# Altium project Front.PrjPCB (part 2 of 2)

## Sheet Connectors.SchDoc
size A; SheetNumber: 13
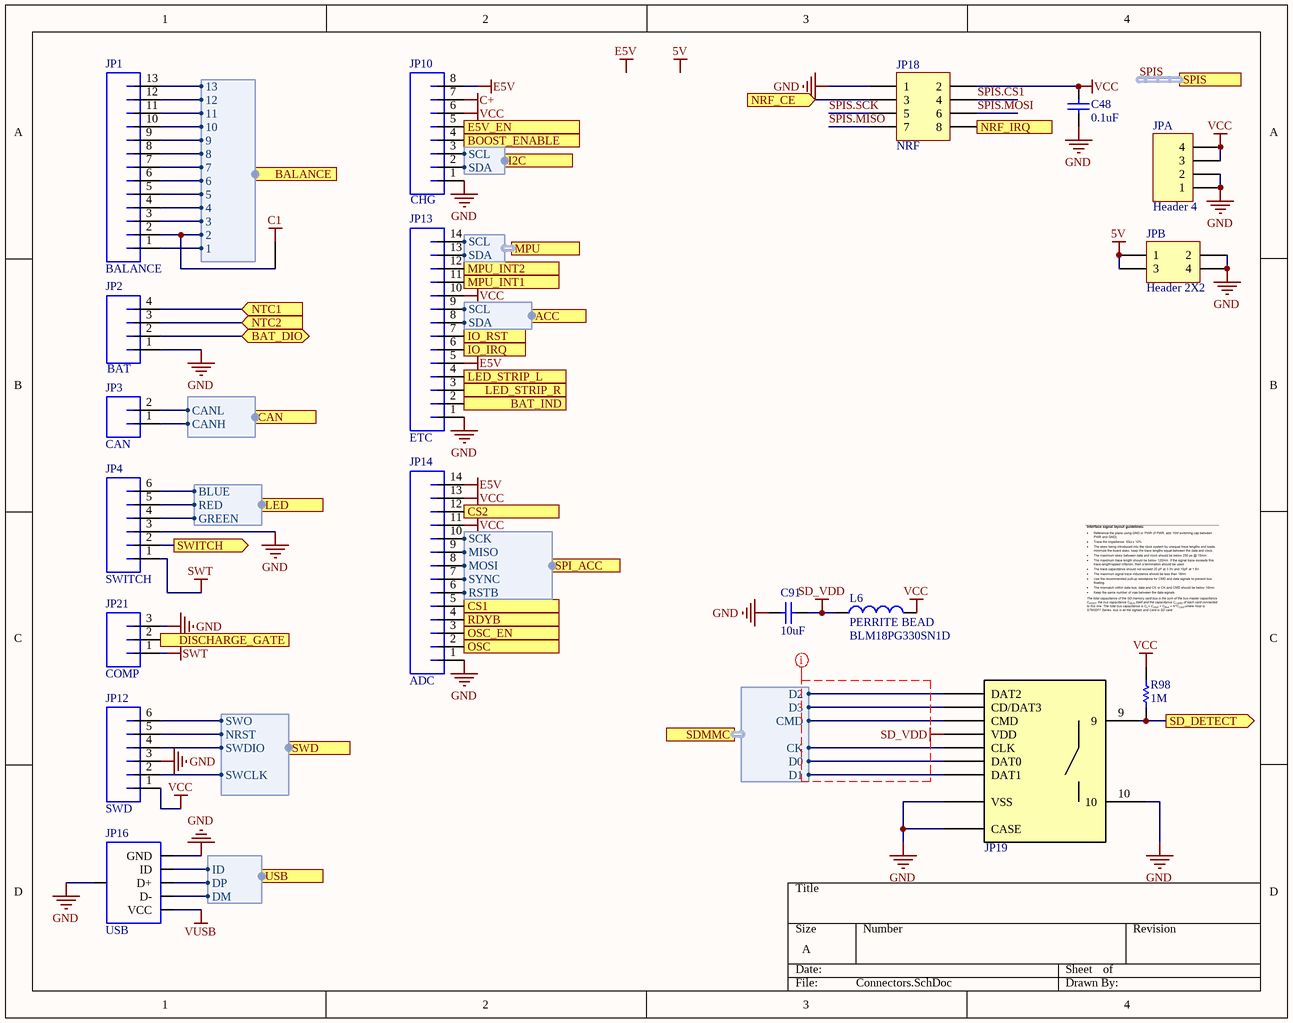
[diagram p6: Connectors.SchDoc]

### Parts
(Parts that share a designator on the sheet are numbered #1, #2 ... from top to bottom, then left to right.)
*1  NetTie  [NetTie]  (value not drawn)  (net tie, no BOM)
C48  value 0.1uF  [C0603[1608X92]]  (hidden comment: 0.1uF 6.3V 0603)
C91  value 10uF  [C0603[1608X92]]  (hidden comment: 10uF 16V 0603)
JP1  BALANCE  [JST-XH-13-PTH-VERT]
JP2  BAT  [JST-PH-4-PTH-VERT]
JP3  CAN  [JST-PH-2-PTH-HORZ]
JP4  SWITCH  [JST-PH-6-PTH-HORZ]
JP10  CHG  [JST-PH-8-PTH-HORZ]
JP12  SWD  [MOLEX_5045_6]
JP13  ETC  [JST-PH-14-PTH-HORZ]
JP14  ADC  [JST-PH-14-PTH-HORZ]
JP16  USB  [USB-MICROB_HORZ]
JP18  NRF  [HDR2X4]
JP19  MICRO SD TOP MOUNT  [MICRO SD_502570]  (value not drawn)
JP21  COMP  [JST-PH-3-PTH-HORZ]
JPA  Header 4  [HDR1X4]
JPB  Header 2X2  [HDR2X2]
L6#2  Type: PERRITE BEAD  PartNumber: BLM18PG330SN1D  [IND0603]  (hidden comment: 33Ohm)
R98  value 1M  [R0603[1608]]  (hidden comment: 1M 5% 0603)

### Ports
ACC (harness I2C), BALANCE (harness Balance), BAT_DIO (bidir), BAT_IND (in), BOOST_ENABLE (in), CAN (harness CAN Output), CS1 (out), CS2 (out), DISCHARGE_GATE (out), E5V_EN (in), I2C (harness I2C), IO_IRQ (out), IO_RST (in), LED (harness LED), LED_STRIP_L (in), LED_STRIP_R (in), MPU (harness I2C), MPU_INT1 (out), MPU_INT2 (out), NRF_CE (in), NRF_IRQ (out), NTC1 (in), NTC2 (in), OSC (out), OSC_EN (out), RDYB (out), SD_DETECT (out), SDMMC (harness SDMMC), SPI_ACC (harness SPI_ADC), SPIS (harness SPI), SWD (harness SWD), SWITCH (out), USB (harness USB)

### Harnesses
CAN Output: CANL, CANH
Balance: 13, 12, 11, 10, 9, 8, 6, 7, 5, 3, 4, 2, 1
I2C: SCL, SDA
SWD: SWCLK, SWDIO, SWO, NRST
LED: RED, BLUE, GREEN
SDMMC: D2, D3, CMD, CK, D0, D1
SPI_ADC: MOSI, MISO, SCK, SYNC, RSTB
USB: DM, DP, ID

### Nets
5V: JPB.1 JPB.3
C1: *1.2
C+: JP10.7
E5V: JP10.8 JP13.5 JP14.14
GND: C48.1 C91.2 JP2.1 JP4.3 JP10.1 JP12.3 JP13.1 JP14.1 JP16.GND JP16.MT1(SHIELD) JP18.1 JP19.10 JP19.CASE JP19.VSS JP21.3 JPA.1 JPA.2 JPB.2 JPB.4
SD_VDD: C91.1 JP19.VDD L6#2.1
SWT: JP4.1 JP21.1
VCC: C48.2 JP10.6 JP12.1 JP13.10 JP14.11 JP14.13 JP18.2 JPA.3 JPA.4 L6#2.2 R98.1
VUSB: JP16.VBUS(VCC)
ACC.SCL: JP13.9 ; port ACC.SCL
ACC.SDA: JP13.8 ; port ACC.SDA
BAT_DIO: JP2.2 ; port BAT_DIO
BAT_IND: JP13.2 ; port BAT_IND
BOOST: JP10.4 ; port BOOST_ENABLE
CELL0: JP1.1 ; port BALANCE.1
CELL1: *1.1 JP1.2 ; port BALANCE.2
CELL2: JP1.3 ; port BALANCE.3
CELL3: JP1.4 ; port BALANCE.4
CELL4: JP1.5 ; port BALANCE.5
CELL5: JP1.6 ; port BALANCE.6
CELL6: JP1.7 ; port BALANCE.7
CELL7: JP1.8 ; port BALANCE.8
CELL8: JP1.9 ; port BALANCE.9
CELL9: JP1.10 ; port BALANCE.10
CELL10: JP1.11 ; port BALANCE.11
CELL11: JP1.12 ; port BALANCE.12
CELL12: JP1.13 ; port BALANCE.13
I2C_MPU.SCL: JP13.14 ; port MPU.SCL
I2C_MPU.SDA: JP13.13 ; port MPU.SDA
I2C_SYS.SCL: JP10.3 ; port I2C.SCL
I2C_SYS.SDA: JP10.2 ; port I2C.SDA
IO_IRQ: JP13.6 ; port IO_IRQ
IO_RST: JP13.7 ; port IO_RST
LED.BLUE: JP4.6 ; port LED.BLUE
LED.GREEN: JP4.4 ; port LED.GREEN
LED.RED: JP4.5 ; port LED.RED
LED_STRIP_L: JP13.3 ; port LED_STRIP_R
LED_STRIP_R: JP13.4 ; port LED_STRIP_L
MPU_INT1: JP13.11 ; port MPU_INT1
MPU_INT2: JP13.12 ; port MPU_INT2
NRF_CE: JP18.3 ; port NRF_CE
NRF_IRQ: JP18.8 ; port NRF_IRQ
SD.CK: JP19.CLK ; port SDMMC.CK
SD.CMD: JP19.CMD ; port SDMMC.CMD
SD.D0: JP19.DAT0 ; port SDMMC.D0
SD.D1: JP19.DAT1 ; port SDMMC.D1
SD.D2: JP19.DAT2 ; port SDMMC.D2
SD.D3: JP19.CD/DAT3 ; port SDMMC.D3
SD_DETECT: JP19.9 R98.2 ; port SD_DETECT
SPI_ACC.MISO: JP14.9 ; port SPI_ACC.MISO
SPI_ACC.MOSI: JP14.8 ; port SPI_ACC.MOSI
SPI_ACC.RSTB: JP14.6 ; port SPI_ACC.RSTB
SPI_ACC.SCK: JP14.10 ; port SPI_ACC.SCK
SPI_ACC.SYNC: JP14.7 ; port SPI_ACC.SYNC
SPIS.CS1: JP18.4
SPIS.MISO: JP18.7
SPIS.MOSI: JP18.6
SPIS.SCK: JP18.5
SWD.NRST: JP12.5 ; port SWD.NRST
SWD.SWCLK: JP12.2 ; port SWD.SWCLK
SWD.SWDIO: JP12.4 ; port SWD.SWDIO
SWD.SWO: JP12.6 ; port SWD.SWO
USB_ID: JP16.ID ; port USB.ID
USB_N: JP16.D- ; port USB.DM
USB_P: JP16.D+ ; port USB.DP
NetC1_2: JP2.4 ; port NTC1
NetC90_2: JP2.3 ; port NTC2
NetJP3_1: JP3.1 ; port CAN.CANH
NetJP3_2: JP3.2 ; port CAN.CANL
NetJP4_2: JP4.2 ; port SWITCH
NetJP10_5: JP10.5 ; port E5V_EN
NetJP14_2: JP14.2 ; port OSC
NetJP14_3: JP14.3 ; port OSC_EN
NetJP14_4: JP14.4 ; port RDYB
NetJP14_5: JP14.5 ; port CS1
NetJP14_12: JP14.12 ; port CS2
NetJP21_2: JP21.2 ; port DISCHARGE_GATE

### Buses and harness runs
harness SPIS = port SPIS

### Layout directives
rule Width Constraint [Pref Width = 11.55mil    Min Width = 11.55mil    Max Width = 11.55mil]; net class SD; rule Matched Net Lengths [Tolerance = 100mil]: (no net found under the mark)

### Notes on the sheet
- Labels drawn without touching a wire or pin: 5V, E5V

### Library data of the parts
C48 = CAP_0.1uF_6.3V_0603_10%: as C18 on sheet Charging; Mounting Technology: Surface Mount; PackageReference: 0603; PackageDescription: 0603 (1608 Metric); Voltage: 6.3V; Tolerance: 10%
C91 = CAP_10uF_16V_0603_10%: as C16 on sheet Charging; Mounting Technology: Surface Mount; PackageReference: 0603; PackageDescription: 0603 (1608 Metric); Voltage: 16V; Tolerance: 10%
JP1 = JST_XH_13_VERT: Manufacturer: JST Sales America, Inc.; PartNumber: B13B-XH-A(LF)(SN); Mounting Technology: Through Hole; PackageReference: JST-XH
JP2 = JST_PH_4_VERT: Manufacturer: JST Sales America Inc.; PartNumber: B4B-PH-K-S(LF)(SN); Mounting Technology: Through Hole; PackageReference: JST-PH
JP3 = JST_PH_2_HORZ: Manufacturer: JST Sales America Inc.; PartNumber: B2B-PH-K-S(LF)(SN); Mounting Technology: Through Hole; PackageReference: JST-PH
JP4 = JST_PH_6_HORZ: PartNumber: S6B-PH-K-S; Manufacturer: JST Sales America Inc.; PackageReference: JST-PH; Mounting Technology: Through Hole
JP10 = JST_PH_8_HORZ: PartNumber: S8B-PH-K-S(LF)(SN); Manufacturer: JST Sales America Inc.; PackageReference: JST-PH; Mounting Technology: Through Hole
JP12 = MOLEX_5045_6: PartNumber: B6B-PH-K-S(LF)(SN); Manufacturer: JST Sales America Inc.; PackageReference: JST-PH; Mounting Technology: Through Hole
JP13 JP14 = JST_PH_14_HORZ: PartNumber: S14B-PH-K-S(LF)(SN); Manufacturer: JST Sales America Inc.; Mounting Technology: Through Hole; PackageReference: JST-PH
JP16 = USB_MICROB_HORZ: pin to pad: MT1>MT1+P$1+P$2+MT2; PartNumber: 10118192-0001LF; Manufacturer: Amphenol FCI; Mounting Technology: Surface Mount; PackageReference: USB - Micro B
JP18 = Header 4X2: Header, 4-Pin, Dual row; LatestRevisionDate: 17-Jul-2002; LatestRevisionNote: Re-released for DXP Platform.; Publisher: Altium Limited
JP19 = MICRO SD_5025: MICRO SD Slot / TOP MOUNT / FRONT; Manufacturer: Molex; PartNumber: 5025700893; Mounting Technology: SMD; PackageReference: Header-1.27mm-2x5
JP21 = JST_PH_3_HORZ: Manufacturer: JST Sales America Inc.; PartNumber: B3B-PH-K-S(LF)(SN); Mounting Technology: Through Hole; PackageReference: JST-PH
JPA = Header 4: Header, 4-Pin; LatestRevisionDate: 17-Jul-2002; LatestRevisionNote: Re-released for DXP Platform.; Publisher: Altium Limited
JPB = Header 2X2: Header, 2-Pin, Dual row; LatestRevisionDate: 17-Jul-2002; LatestRevisionNote: Re-released for DXP Platform.; Publisher: Altium Limited
L6#2 = PER_33Ohm_3A_0603: 33Ohm 3A 0603 Perrite Bead; Manufacturer: Murata; PackageReference: 0603; PackageDescription: 0603 (1608 metric); Mounting Technology: Surface Mount; Current: 3A; Value: 33Ohm
R98 = RES_1M_0603_5%: as R67 on sheet MCU; Tolerance: 5%; Power: 0.25W; Mounting Technology: Surface Mount; PackageReference: 0603; PackageDescription: 0603 (1608 Metric); ComponentLink1Description: Datasheet; ComponentLink1URL: http://www.vishay.com/docs/20043/crcwhpe3.pdf

## Sheet CAN.SchDoc
size A; SheetNumber: 9
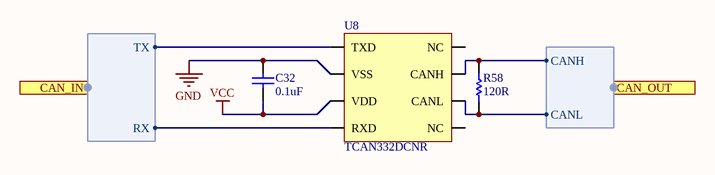
[diagram p7: CAN.SchDoc]

### Parts
C32  value 0.1uF  [C0603[1608X92]]  (hidden comment: 0.1uF 6.3V 0603)
R58  value 120R  [R0603[1608]]  (hidden comment: 120R 1% 0603)
U8  TCAN332DCNR  [SOT-23-8]

### Ports
CAN_IN (harness CAN Input), CAN_OUT (harness CAN Output)

### Harnesses
CAN Input: TX, RX
CAN Output: CANH, CANL

### Nets
GND: C32.2 U8.2(VSS)
VCC: C32.1 U8.3(VDD)
CAN.RX: U8.4(RXD) ; port CAN_IN.RX
CAN.TX: U8.1(TXD) ; port CAN_IN.TX
NetJP3_1: R58.2 U8.7(CANH) ; port CAN_OUT.CANH
NetJP3_2: R58.1 U8.6(CANL) ; port CAN_OUT.CANL

Not connected (* = marked no-connect by the designer): U8 5(NC) 8(NC)

### Library data of the parts
C32 = CAP_0.1uF_6.3V_0603_10%: as C18 on sheet Charging; Mounting Technology: Surface Mount; PackageReference: 0603; PackageDescription: 0603 (1608 Metric); Voltage: 6.3V; Tolerance: 10%
R58 = RES_120R_0603_1%: 120R 0.25W 1% 0603 (1005 Metric); Manufacturer: Vishay / Dale; PartNumber: CRCW0603120RFKEAHP; Tolerance: 1%; Power: 0.25W; Mounting Technology: Surface Mount; PackageReference: 0603; PackageDescription: 0603 (1608 Metric); ComponentLink1Description: Datasheet; ComponentLink1URL: http://www.vishay.com/docs/20043/crcwhpe3.pdf
U8 = TCAN332DCNR: CAN Interface IC 3.3-V CAN Transceivers with CAN FD (Flexible Data Rate) 8-SOT-23 -40 to 125; Manufacturer: Texas Instruments; Mounting Technology: Surface Mount; PackageReference: SOT-23-8; PackageDescription: SOT23, 8-Leads; PartNumber: TCAN332DCNR

## Sheet RTCC.SchDoc
size A; SheetNumber: 10
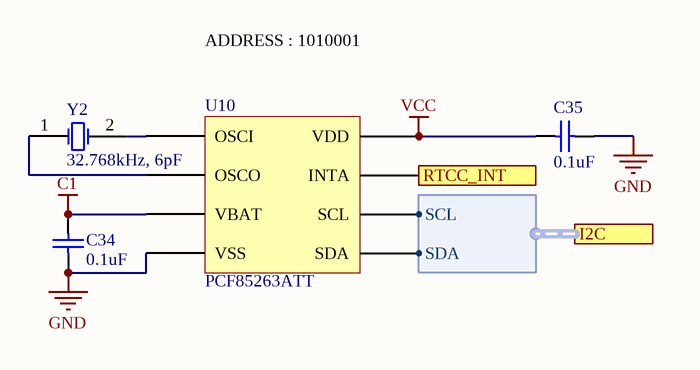
[diagram p8: RTCC.SchDoc]

### Parts
C34  value 0.1uF  [C0603[1608X92]]  (hidden comment: 0.1uF 6.3V 0603)
C35  value 0.1uF  [C0603[1608X92]]  (hidden comment: 0.1uF 6.3V 0603)
U10  PCF85263ATT  [TSSOP-8]
Y2  32.768kHz, 6pF  [ST3215SB]

### Ports
I2C (harness I2C), RTCC_INT (out)

### Harnesses
I2C: SCL, SDA

### Nets
C1: C34.2 U10.3(VBAT)
GND: C34.1 C35.2 U10.4(VSS)
VCC: C35.1 U10.8(VDD)
I2C_SYS.SCL: U10.6(SCL) ; port I2C.SCL
I2C_SYS.SDA: U10.5(SDA) ; port I2C.SDA
RTCC_INT: U10.7(INTA) ; port RTCC_INT
NetU10_1: U10.1(OSCI) Y2.2(X2)
NetU10_2: U10.2(OSCO) Y2.1(X1)

### Notes on the sheet
- ADDRESS : 1010001

### Library data of the parts
C34 C35 = CAP_0.1uF_6.3V_0603_10%: as C18 on sheet Charging; Mounting Technology: Surface Mount; PackageReference: 0603; PackageDescription: 0603 (1608 Metric); Voltage: 6.3V; Tolerance: 10%
U10 = PCF85263ATT: Real Time Clock Real-Time Clock calendar; PartNumber: PCF85263ATT/AJ; Manufacturer: Texas Instruments; Mounting Technology: Surface Mount; PackageReference: TSSOP-8
Y2 = ST3215SB32768B0HPWB3: 32.768kHz ±20ppm Crystal 6pF 60 kOhm -40°C ~ 85°C Surface Mount 2-SMD, No Lead (DFN, LCC); Manufacturer: AVX/Kyocera; PackageDescription: 2-SMD, No Lead (DFN, LCC); PackageReference: ST3215SB; Mounting Technology: Surface Mount; PartNumber: ST3215SB32768B0HPWB3

## Sheet Buzzer.SchDoc
size A; SheetNumber: 11
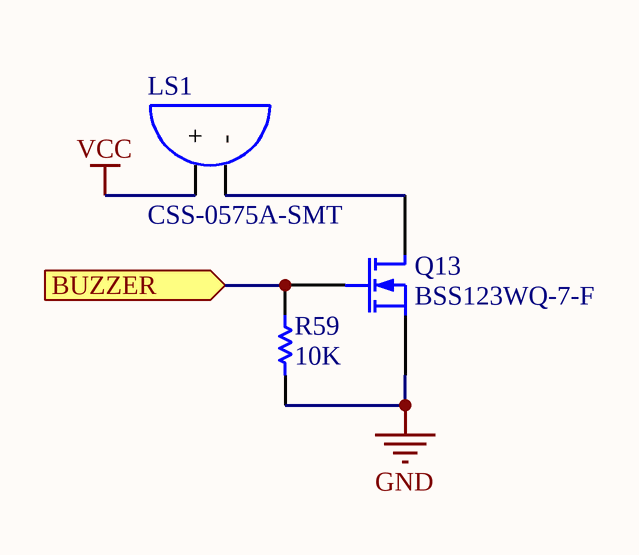
[diagram p9: Buzzer.SchDoc]

### Parts
LS1  CSS-0575A-SMT  [CSS-0575A-SMT]
Q13  BSS123WQ-7-F  [SOT323-3]
R59  value 10K  [R0603[1608]]  (hidden comment: 10K 1% 0603)

### Ports
BUZZER (in)

### Nets
GND: Q13.2(S) R59.1
VCC: LS1.1(+)
BUZZER: Q13.1(G) R59.2 ; port BUZZER
NetLS1_2: LS1.2(-) Q13.3(D)

### Library data of the parts
LS1 = CSS-0575A-SMT: Magnetic Buzzer Transducer; Manufacturer: CUI, Inc.; PartNumber: CSS-0575A-SMT; Mounting Technology: Surface Mount; PackageReference: 5x5x1.9mm
Q13 = BSS123WQ-7-F: N-Channel MOSFET; Manufacturer: Diodes Incorporated; PackageReference: SOT-323-3; PartNumber: BSS123WQ-7-F; Mounting Technology: Surface Mount
R59 = RES_10K_0603_1%: as R28 on sheet Charging; Tolerance: 1%; Power: 0.25W; Mounting Technology: Surface Mount; PackageReference: 0603; PackageDescription: 0603 (1608 Metric); ComponentLink1Description: Datasheet; ComponentLink1URL: http://www.vishay.com/docs/20065/rcse3.pdf

## Sheet CurrentSense.SchDoc
size A; SheetNumber: 8
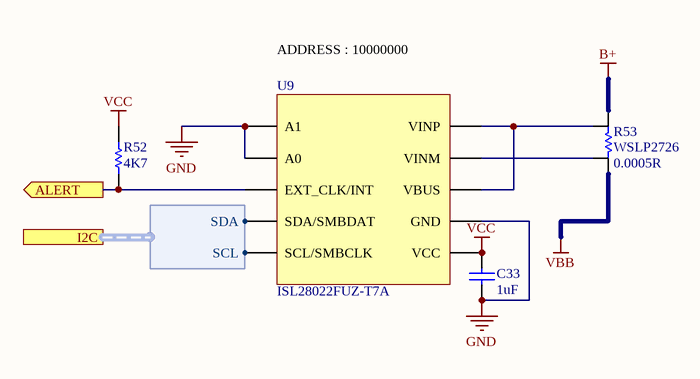
[diagram p10: CurrentSense.SchDoc]

### Parts
C33  value 1uF  [C0603[1608X92]]  (hidden comment: 1uF 6.3V 0603)
R52  value 4K7  [R0603[1608]]  (hidden comment: 4K7 1% 0603)
R53  WSLP2726  value 0.0005R  [WSL2726]
U9  ISL28022FUZ-T7A  [MSOP-10]

### Ports
ALERT (out), I2C (harness I2C)

### Harnesses
I2C: SCL, SDA

### Nets
B+: R53.2
GND: C33.1 U9.1(A1) U9.2(A0) U9.7(GND)
VBB: R53.1
VCC: C33.2 R52.2 U9.6(VCC)
ALERT: R52.1 U9.3(EXT_CLK/INT) ; port ALERT
I2C_SYS.SCL: U9.5(SCL/SMBCLK) ; port I2C.SCL
I2C_SYS.SDA: U9.4(SDA/SMBDAT) ; port I2C.SDA
NetR53_3: R53.3 U9.9(VINM)
NetR53_4: R53.4 U9.8(VBUS) U9.10(VINP)

### Notes on the sheet
- ADDRESS : 10000000

### Library data of the parts
C33 = CAP_1uF_6.3V_0603_10%: as C26 on sheet 3V3; Mounting Technology: Surface Mount; PackageReference: 0603; PackageDescription: 0603 (1608 Metric); Voltage: 6.3V; Tolerance: 10%
R52 = RES_4K7_0603_1%: 4K7 0.25W 1% 0603 (1005 Metric); Manufacturer: Vishay / Dale; PartNumber: CRCW06034K70FKEAHP; Tolerance: 1%; Power: 0.25W; Mounting Technology: Surface Mount; PackageReference: 0603; PackageDescription: 0603 (1608 Metric); ComponentLink1Description: Datasheet; ComponentLink1URL: http://www.vishay.com/docs/20043/crcwhpe3.pdf
R53 = WSLP2726: Current Sense Resistor, 0.0005R; PartNumber: WSLP2726L5000FEA; Manufacturer: Vishay / Dale; Power: 7W; Tolerance: 1%; PackageReference: 2726; Mounting Technology: Surface Mount
U9 = ISL28022FUZ-T7A: Manufacturer: Intersil; PartNumber: ISL28022FUZ-T7A; Mounting Technology: Surface Mount; PackageReference: MSOP-10

## Sheet LTC6803.SchDoc
size A; SheetNumber: 4
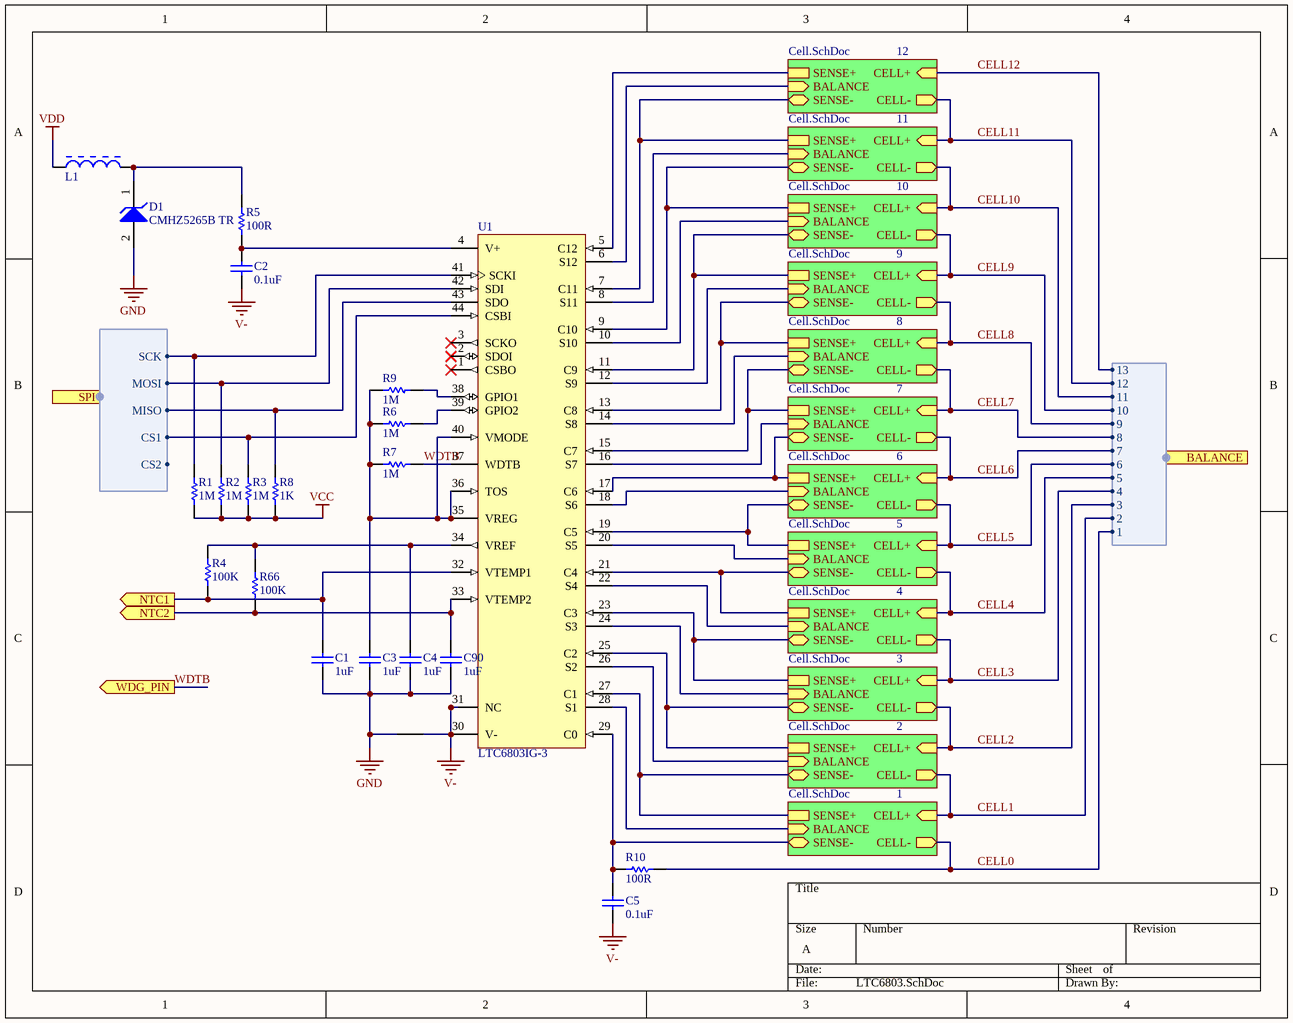
[diagram p11: LTC6803.SchDoc]

### Parts
*  NetTie  [NetTie]  (value not drawn)  (net tie, no BOM)
C1  value 1uF  [C0603[1608X92]]  (hidden comment: 1uF 6.3V 0603)
C2  value 0.1uF  [C0603[1608X92]]  (hidden comment: 0.1uF 100V 0603)
C3  value 1uF  [C0603[1608X92]]  (hidden comment: 1uF 6.3V 0603)
C4  value 1uF  [C0603[1608X92]]  (hidden comment: 1uF 6.3V 0603)
C5  value 0.1uF  [C0603[1608X92]]  (hidden comment: 0.1uF 6.3V 0603)
C90  value 1uF  [C0603[1608X92]]  (hidden comment: 1uF 6.3V 0603)
D1  CMHZ5265B TR  [SOD-123]
L1  MURA-FB-2  [MURA-BLM31-B60-CHIP-2_V3]  (value not drawn)
R1  value 1M  [R0603[1608]]  (hidden comment: 1M 5% 0603)
R2  value 1M  [R0603[1608]]  (hidden comment: 1M 5% 0603)
R3  value 1M  [R0603[1608]]  (hidden comment: 1M 5% 0603)
R4  value 100K  [R0603[1608]]  (hidden comment: 100K 1% 0603)
R5  value 100R  [R0603[1608]]  (hidden comment: 100R 1% 0603)
R6  value 1M  [R0603[1608]]  (hidden comment: 1M 5% 0603)
R7  value 1M  [R0603[1608]]  (hidden comment: 1M 5% 0603)
R8  value 1K  [R0603[1608]]  (hidden comment: 1K 1% 0603)
R9  value 1M  [R0603[1608]]  (hidden comment: 1M 5% 0603)
R10  value 100R  [R0603[1608]]  (hidden comment: 100R 1% 0603)
R66  value 100K  [R0603[1608]]  (hidden comment: 100K 1% 0603)
U1  LTC6803IG-3  [TSSOP-44]

### Sub-sheets
1 = Cell.SchDoc: SENSE+, SENSE- (bidir), BALANCE (in), CELL+ (in), CELL- (out)
2 = Cell.SchDoc: SENSE+, SENSE- (bidir), BALANCE (in), CELL+ (in), CELL- (out)
3 = Cell.SchDoc: SENSE+, SENSE- (bidir), BALANCE (in), CELL+ (in), CELL- (out)
4 = Cell.SchDoc: SENSE+, SENSE- (bidir), BALANCE (in), CELL+ (in), CELL- (out)
5 = Cell.SchDoc: SENSE+, SENSE- (bidir), BALANCE (in), CELL+ (in), CELL- (out)
6 = Cell.SchDoc: SENSE+, SENSE- (bidir), BALANCE (in), CELL+ (in), CELL- (out)
7 = Cell.SchDoc: SENSE+, SENSE- (bidir), BALANCE (in), CELL+ (in), CELL- (out)
8 = Cell.SchDoc: SENSE+, SENSE- (bidir), BALANCE (in), CELL+ (in), CELL- (out)
9 = Cell.SchDoc: SENSE+, SENSE- (bidir), BALANCE (in), CELL+ (in), CELL- (out)
10 = Cell.SchDoc: SENSE+, SENSE- (bidir), BALANCE (in), CELL+ (in), CELL- (out)
11 = Cell.SchDoc: SENSE+, SENSE- (bidir), BALANCE (in), CELL+ (in), CELL- (out)
12 = Cell.SchDoc: SENSE+, SENSE- (bidir), BALANCE (in), CELL+ (in), CELL- (out)

### Ports
BALANCE (harness Balance), NTC1 (out), NTC2 (out), SPI (harness SPI), WDG_PIN (out)

### Harnesses
SPI: SCK, MOSI, MISO, CS1, CS2
Balance: 13, 12, 11, 10, 9, 8, 6, 7, 5, 3, 4, 2, 1

### Nets
GND: *.1 C1.1 C3.1 C4.1 C90.1 D1.2(A)
V-: *.2 C2.1 C5.1 U1.30(V-) U1.31(NC)
VCC: R1.1 R2.1 R3.1 R8.1
VDD: L1.1
CELL0: R10.1 ; sheet 1/CELL-, port BALANCE.1
CELL1: sheet 2/CELL-, sheet 1/CELL+, port BALANCE.2
CELL2: sheet 3/CELL-, sheet 2/CELL+, port BALANCE.3
CELL3: sheet 4/CELL-, sheet 3/CELL+, port BALANCE.4
CELL4: sheet 5/CELL-, sheet 4/CELL+, port BALANCE.5
CELL5: sheet 6/CELL-, sheet 5/CELL+, port BALANCE.6
CELL6: sheet 7/CELL-, sheet 6/CELL+, port BALANCE.7
CELL7: sheet 8/CELL-, sheet 7/CELL+, port BALANCE.8
CELL8: sheet 9/CELL-, sheet 8/CELL+, port BALANCE.9
CELL9: sheet 10/CELL-, sheet 9/CELL+, port BALANCE.10
CELL10: sheet 11/CELL-, sheet 10/CELL+, port BALANCE.11
CELL11: sheet 12/CELL-, sheet 11/CELL+, port BALANCE.12
CELL12: sheet 12/CELL+, port BALANCE.13
SPI_SYS.CS1: R3.2 U1.44(CSBI) ; port SPI.CS1
SPI_SYS.MISO: R8.2 U1.43(SDO) ; port SPI.MISO
SPI_SYS.MOSI: R2.2 U1.42(SDI) ; port SPI.MOSI
SPI_SYS.SCK: R1.2 U1.41(SCKI) ; port SPI.SCK
WDTB: R7.1 U1.37(WDTB) ; port WDG_PIN
NetC1_2: C1.2 R4.1 U1.32(VTEMP1) ; port NTC1
NetC2_2: C2.2 R5.1 U1.4(V+)
NetC3_2: C3.2 R6.2 R7.2 R9.2 U1.35(VREG) U1.36(TOS) U1.40(VMODE)
NetC4_2: C4.2 R4.2 R66.2 U1.34(VREF)
NetC5_2: C5.2 R10.2 U1.29(C0) ; sheet 1/SENSE-
NetC23_1_2: U1.27(C1) ; sheet 2/SENSE-, sheet 1/SENSE+
NetC23_2_2: U1.25(C2) ; sheet 3/SENSE-, sheet 2/SENSE+
NetC23_3_2: U1.23(C3) ; sheet 4/SENSE-, sheet 3/SENSE+
NetC23_4_2: U1.21(C4) ; sheet 5/SENSE-, sheet 4/SENSE+
NetC23_5_2: U1.19(C5) ; sheet 6/SENSE-, sheet 5/SENSE+
NetC23_6_2: U1.17(C6) ; sheet 7/SENSE-, sheet 6/SENSE+
NetC23_7_2: U1.15(C7) ; sheet 8/SENSE-, sheet 7/SENSE+
NetC23_8_2: U1.13(C8) ; sheet 9/SENSE-, sheet 8/SENSE+
NetC23_9_2: U1.11(C9) ; sheet 10/SENSE-, sheet 9/SENSE+
NetC23_10_2: U1.9(C10) ; sheet 11/SENSE-, sheet 10/SENSE+
NetC23_11_2: U1.7(C11) ; sheet 12/SENSE-, sheet 11/SENSE+
NetC23_12_2: U1.5(C12) ; sheet 12/SENSE+
NetC90_2: C90.2 R66.1 U1.33(VTEMP2) ; port NTC2
NetD1_1: D1.1(K) L1.2 R5.2
NetQ3_1_1: U1.28(S1) ; sheet 1/BALANCE
NetQ3_2_1: U1.26(S2) ; sheet 2/BALANCE
NetQ3_3_1: U1.24(S3) ; sheet 3/BALANCE
NetQ3_4_1: U1.22(S4) ; sheet 4/BALANCE
NetQ3_5_1: U1.20(S5) ; sheet 5/BALANCE
NetQ3_6_1: U1.18(S6) ; sheet 6/BALANCE
NetQ3_7_1: U1.16(S7) ; sheet 7/BALANCE
NetQ3_8_1: U1.14(S8) ; sheet 8/BALANCE
NetQ3_9_1: U1.12(S9) ; sheet 9/BALANCE
NetQ3_10_1: U1.10(S10) ; sheet 10/BALANCE
NetQ3_11_1: U1.8(S11) ; sheet 11/BALANCE
NetQ3_12_1: U1.6(S12) ; sheet 12/BALANCE
NetR6_1: R6.1 U1.39(GPIO2)
NetR9_1: R9.1 U1.38(GPIO1)

Not connected (* = marked no-connect by the designer): U1 1(CSBO)* 2(SDOI)* 3(SCKO)*

### Library data of the parts
C1 C3 C4 C90 = CAP_1uF_6.3V_0603_10%: 1uF 6.3V 10% 0603 (1608 Metric); PartNumber: GRM188R60J105KA01D; Manufacturer: Murata; TemperatureCoefficient: X5R; Mounting Technology: Surface Mount; PackageReference: 0603; PackageDescription: 0603 (1608 Metric); Voltage: 6.3V; Tolerance: 10%
C2 = CAP_0.1uF_100V_0603_10%: 0.1uF 100V 10% 0603 (1608 Metric); PartNumber: GRM188R72A104KA35D; Manufacturer: Murata; TemperatureCoefficient: X7R; Mounting Technology: Surface Mount; PackageReference: 0603; PackageDescription: 0603 (1608 Metric); Voltage: 100V; Tolerance: 10%
C5 = CAP_0.1uF_6.3V_0603_10%: 0.1uF 6.3V 10% 0603 (1608 Metric); PartNumber: GRM188R70J104KA01D; Manufacturer: Murata; Mounting Technology: Surface Mount; PackageReference: 0603; PackageDescription: 0603 (1608 Metric); Voltage: 6.3V; Tolerance: 10%
D1 = CMHZ5265B: Zener Diodes 500mW Zener Diode 185mA 58.9V to 2V; Manufacturer: Central Semiconductor; PartNumber: CMHZ5265B; Mounting Technology: Surface Mount; PackageReference: SOD-123; PackageDescription: SOD, 2-Leads, Body 2.69x1.6mm
L1 = MURA-FB-2: EMI Filter Beads, Chips & Arrays 1206 33 OHM; PartNumber: BLM31PG330SN1L; Manufacturer: Murata; Mounting Technology: Surface Mount; PackageReference: 1206; PackageDescription: 1206 (3216 Metric)
R1-R3 R6 R7 R9 = RES_1M_0603_5%: 1M 0.25W 5% 0603 (1005 Metric); Manufacturer: Panasonic; PartNumber: ERJ-PA3J105V; Tolerance: 5%; Power: 0.25W; Mounting Technology: Surface Mount; PackageReference: 0603; PackageDescription: 0603 (1608 Metric); ComponentLink1Description: Datasheet; ComponentLink1URL: http://www.vishay.com/docs/20043/crcwhpe3.pdf
R4 R66 = RES_100K_0603_1%: 100K 0.25W 1% 0603 (1005 Metric); Manufacturer: Vishay / Dale; PartNumber: CRCW0603100KFKEAHP; Tolerance: 1%; Power: 0.25W; Mounting Technology: Surface Mount; PackageReference: 0603; PackageDescription: 0603 (1608 Metric); ComponentLink1Description: Datasheet; ComponentLink1URL: http://www.vishay.com/docs/20043/crcwhpe3.pdf
R5 R10 = RES_100R_0603_1%: 100R 0.25W 1% 0603 (1005 Metric); Manufacturer: Vishay / Dale; PartNumber: CRCW0603100RFKEAHP; Tolerance: 1%; Power: 0.25W; Mounting Technology: Surface Mount; PackageReference: 0603; PackageDescription: 0603 (1608 Metric); ComponentLink1Description: Datasheet; ComponentLink1URL: http://www.vishay.com/docs/20043/crcwhpe3.pdf
R8 = RES_1K_0603_1%: 1K 0.25W 1% 0603 (1005 Metric); Manufacturer: Vishay / Dale; PartNumber: CRCW06031K00FKEAHP; Tolerance: 1%; Power: 0.25W; Mounting Technology: Surface Mount; PackageReference: 0603; PackageDescription: 0603 (1608 Metric); ComponentLink1Description: Datasheet; ComponentLink1URL: http://www.vishay.com/docs/20043/crcwhpe3.pdf
U1 = LTC6803IG-3: PartNumber: LTC6803IG-3#PBF; Manufacturer: Linear Technology; PackageReference: TSSOP-44; Mounting Technology: Surface Mount; PackageDescription: SOP, 44-Leads, Body 13.1x5.6mm, Pitch 0.5mm

## Sheet Cell.SchDoc
size A; SheetNumber: 5
Used 12 times, as channels U_LTC6803/12, U_LTC6803/11, U_LTC6803/10, U_LTC6803/9, U_LTC6803/8, U_LTC6803/7, U_LTC6803/6, U_LTC6803/5, U_LTC6803/4, U_LTC6803/3, U_LTC6803/2, U_LTC6803/1. Parts and nets are listed once, with the designators drawn on the sheet.
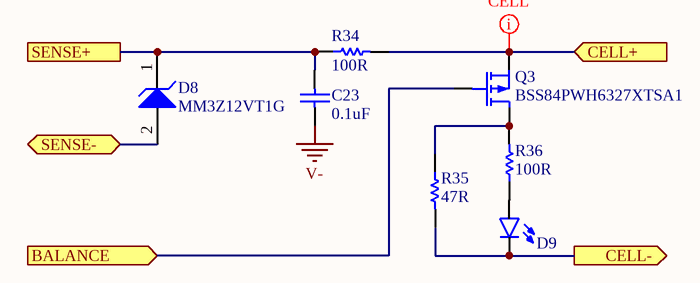
[diagram p12: Cell.SchDoc]

### Parts
C23  value 0.1uF  [C0603[1608X92]]  (hidden comment: 0.1uF 100V 0603)
D8  MM3Z12VT1G  [SOD-323]
D9  LED_0603_BLUE_5mA  [LED0603]  (value not drawn)
Q3  BSS84PWH6327XTSA1  [SOT323-3]
R34  value 100R  [R0603[1608]]  (hidden comment: 100R 1% 0603)
R35  value 47R  [R0805[2012]]  (hidden comment: 47R 5% 0805)
R36  value 100R  [R0603[1608]]  (hidden comment: 100R 1% 0603)

### Ports
BALANCE (in), CELL+ (in), CELL- (out), SENSE+, SENSE- (bidir)

### Nets
V-: C23.1
BALANCE: Q3.1(G) ; port BALANCE
CELL+: Q3.2(S) R34.1 ; port CELL+
CELL-: D9.C R35.1 ; port CELL-
SENSE+: C23.2 D8.1(K) R34.2 ; port SENSE+
SENSE-: D8.2(A) ; port SENSE-
NetD9_A: D9.A R36.2
NetQ3_3: Q3.3(D) R35.2 R36.1

### Channels
U_LTC6803/12: designators end in _12; ports BALANCE=NetQ3_12_1 CELL+=CELL12 CELL-=CELL11 SENSE+=NetC23_12_2 SENSE-=NetC23_11_2
U_LTC6803/11: designators end in _11; ports BALANCE=NetQ3_11_1 CELL+=CELL11 CELL-=CELL10 SENSE+=NetC23_11_2 SENSE-=NetC23_10_2
U_LTC6803/10: designators end in _10; ports BALANCE=NetQ3_10_1 CELL+=CELL10 CELL-=CELL9 SENSE+=NetC23_10_2 SENSE-=NetC23_9_2
U_LTC6803/9: designators end in _9; ports BALANCE=NetQ3_9_1 CELL+=CELL9 CELL-=CELL8 SENSE+=NetC23_9_2 SENSE-=NetC23_8_2
U_LTC6803/8: designators end in _8; ports BALANCE=NetQ3_8_1 CELL+=CELL8 CELL-=CELL7 SENSE+=NetC23_8_2 SENSE-=NetC23_7_2
U_LTC6803/7: designators end in _7; ports BALANCE=NetQ3_7_1 CELL+=CELL7 CELL-=CELL6 SENSE+=NetC23_7_2 SENSE-=NetC23_6_2
U_LTC6803/6: designators end in _6; ports BALANCE=NetQ3_6_1 CELL+=CELL6 CELL-=CELL5 SENSE+=NetC23_6_2 SENSE-=NetC23_5_2
U_LTC6803/5: designators end in _5; ports BALANCE=NetQ3_5_1 CELL+=CELL5 CELL-=CELL4 SENSE+=NetC23_5_2 SENSE-=NetC23_4_2
U_LTC6803/4: designators end in _4; ports BALANCE=NetQ3_4_1 CELL+=CELL4 CELL-=CELL3 SENSE+=NetC23_4_2 SENSE-=NetC23_3_2
U_LTC6803/3: designators end in _3; ports BALANCE=NetQ3_3_1 CELL+=CELL3 CELL-=CELL2 SENSE+=NetC23_3_2 SENSE-=NetC23_2_2
U_LTC6803/2: designators end in _2; ports BALANCE=NetQ3_2_1 CELL+=CELL2 CELL-=CELL1 SENSE+=NetC23_2_2 SENSE-=NetC23_1_2
U_LTC6803/1: designators end in _1; ports BALANCE=NetQ3_1_1 CELL+=CELL1 CELL-=CELL0 SENSE+=NetC23_1_2 SENSE-=NetC5_2

### Layout directives
net class CELL: CELL12

### Library data of the parts
C23 = CAP_0.1uF_100V_0603_10%: as C2 on sheet LTC6803; Mounting Technology: Surface Mount; PackageReference: 0603; PackageDescription: 0603 (1608 Metric); Voltage: 100V; Tolerance: 10%
D8 = MM3Z12VT1G: Zener Voltage Regulator, 300 mW, 2-Pin SOD-323, Tape and Reel; Manufacturer: ON Semiconductor; Mounting Technology: Surface Mount; PackageDescription: SOD, 2-Leads; PartNumber: MM3Z12VT1G; PackageReference: SOD-323
D9 = LED_0603_BLUE_5mA: PartNumber: LTST-C193TBKT-5A; Manufacturer: Lite-On Inc.; PackageReference: 0603; PackageDescription: 0603 (1608 Metric); Mounting Technology: Surface Mount
Q3 = BSS84PW H6327: P-Channel MOSFET; Manufacturer: Infineon; Mounting Technology: Surface Mount; PartNumber: BSS84PWH6327XTSA1; PackageReference: SOT323-3
R34 R36 = RES_100R_0603_1%: as R5 on sheet LTC6803; Tolerance: 1%; Power: 0.25W; Mounting Technology: Surface Mount; PackageReference: 0603; PackageDescription: 0603 (1608 Metric); ComponentLink1Description: Datasheet; ComponentLink1URL: http://www.vishay.com/docs/20043/crcwhpe3.pdf
R35 = RES_47R_0805_5%: 47R 0.5W 5% 0805 (2012 Metric); Manufacturer: Panasonic; PartNumber: ERJ-P06J470V; Tolerance: 5%; Power: 0.5W; Mounting Technology: Surface Mount; PackageReference: 0805; PackageDescription: 0805 (2012 Metric); ComponentLink1Description: Datasheet; ComponentLink1URL: https://industrial.panasonic.com/cdbs/www-data/pdf/RDA0000/AOA0000C243.pdf

## Sheet Flash.SchDoc
size A; SheetNumber: 12
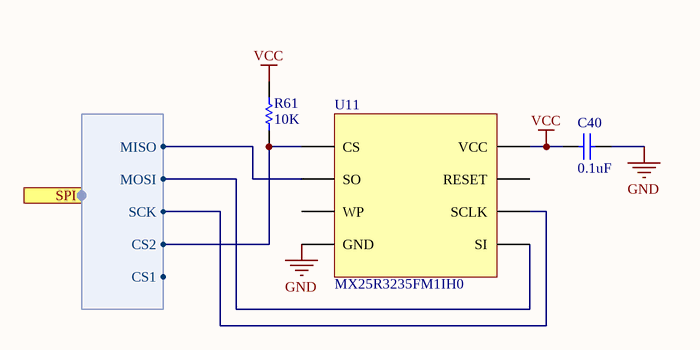
[diagram p13: Flash.SchDoc]

### Parts
C40  value 0.1uF  [C0603[1608X92]]  (hidden comment: 0.1uF 6.3V 0603)
R61  value 10K  [R0603[1608]]  (hidden comment: 10K 1% 0603)
U11  MX25R3235FM1IH0  [SOIC-8]

### Ports
SPI (harness SPI)

### Harnesses
SPI: SCK, MOSI, MISO, CS2, CS1

### Nets
GND: C40.2 U11.4(GND)
VCC: C40.1 R61.2 U11.8(VCC)
SPI_SYS.CS2: R61.1 U11.1(CS) ; port SPI.CS2
SPI_SYS.MISO: U11.2(SO) ; port SPI.MISO
SPI_SYS.MOSI: U11.5(SI) ; port SPI.MOSI
SPI_SYS.SCK: U11.6(SCLK) ; port SPI.SCK

Not connected (* = marked no-connect by the designer): U11 3(WP) 7(RESET)

### Library data of the parts
C40 = CAP_0.1uF_6.3V_0603_10%: as C5 on sheet LTC6803; Mounting Technology: Surface Mount; PackageReference: 0603; PackageDescription: 0603 (1608 Metric); Voltage: 6.3V; Tolerance: 10%
R61 = RES_10K_0603_1%: 10K 0.25W 1% 0603 (1005 Metric); Manufacturer: Vishay / Dale; PartNumber: CRCW060310K0FKEAHP; Tolerance: 1%; Power: 0.25W; Mounting Technology: Surface Mount; PackageReference: 0603; PackageDescription: 0603 (1608 Metric); ComponentLink1Description: Datasheet; ComponentLink1URL: http://www.vishay.com/docs/20065/rcse3.pdf
U11 = MX25R3235FM1IH0: IC FLASH 32M(4M x 8) SPI 80MHZ 8SOP; Manufacturer: Macronix; PartNumber: MX25R3235FM1IH0; Mounting Technology: Surface Mount; PackageReference: SOP-8

## Sheet ADS1257.SchDoc
size A4
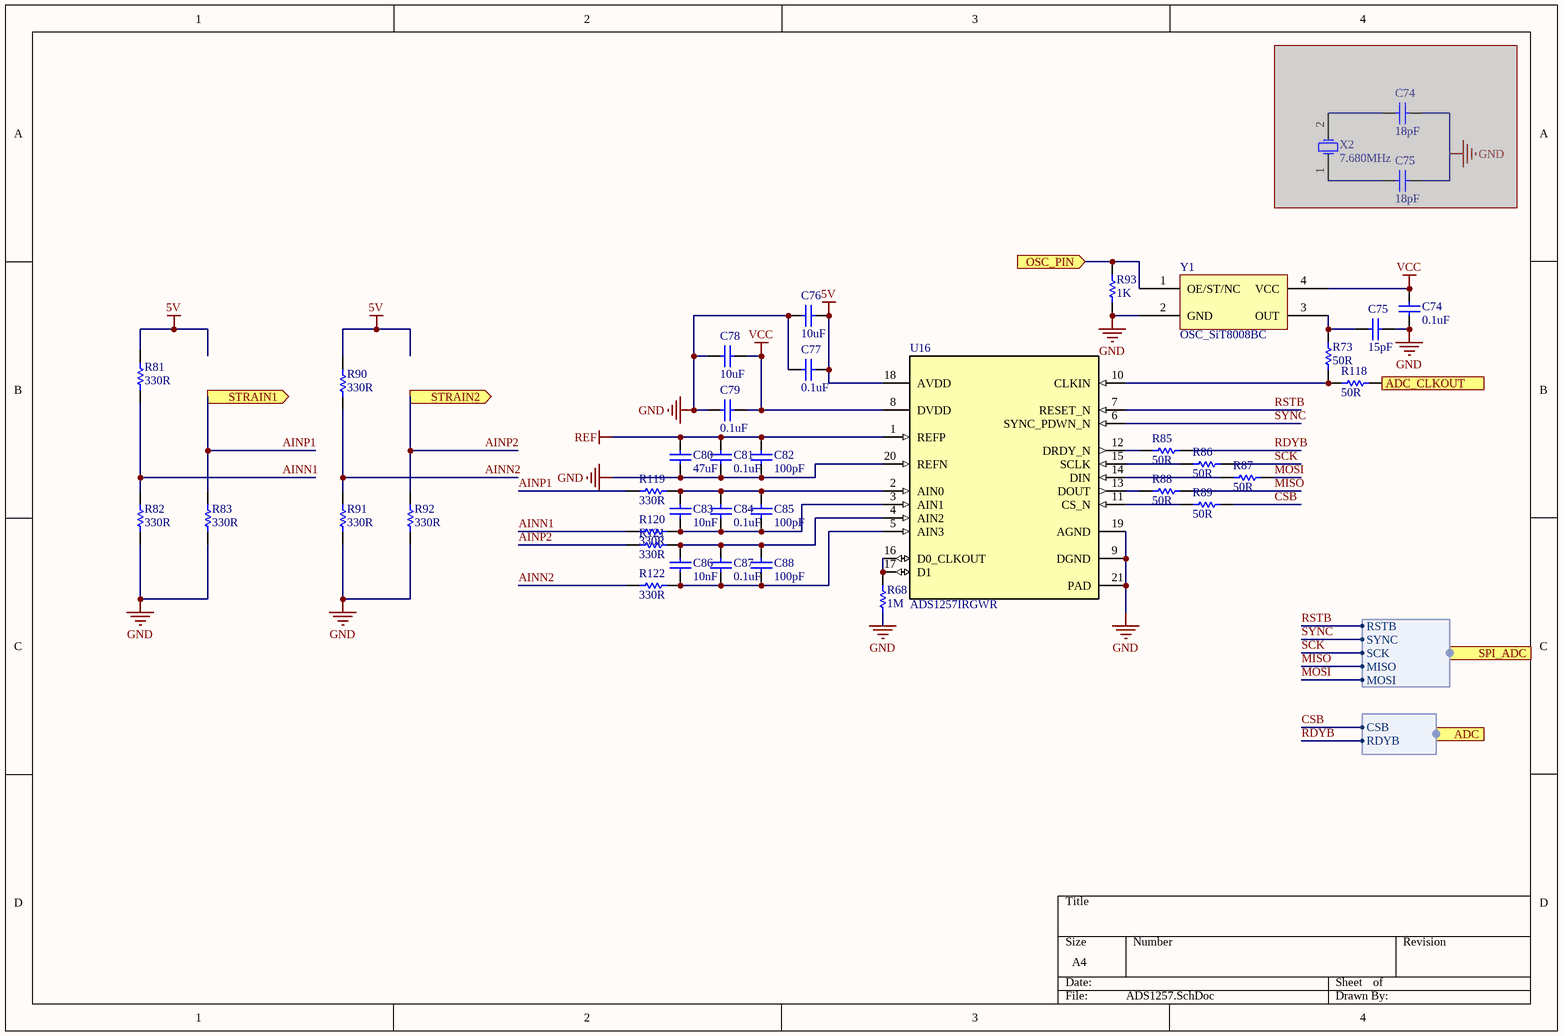
[diagram p14: ADS1257.SchDoc]

### Parts
(Parts that share a designator on the sheet are numbered #1, #2 ... from top to bottom, then left to right.)
C74#1  value 18pF  [C0603[1608X92]]  (hidden comment: 18pF 50V 0603)  (masked out: inside a compile mask, not in the netlist)
C74#2  value 0.1uF  [C0603[1608X92]]  (hidden comment: 0.1uF 16V 0603)
C75#1  value 18pF  [C0603[1608X92]]  (hidden comment: 18pF 50V 0603)  (masked out: inside a compile mask, not in the netlist)
C75#2  value 15pF  [C0603[1608X92]]  (hidden comment: 15pF 50V 0603)
C76  value 10uF  [C0603[1608X92]]  (hidden comment: 10uF 16V 0603)
C77  value 0.1uF  [C0603[1608X92]]  (hidden comment: 0.1uF 16V 0603)
C78  value 10uF  [C0603[1608X92]]  (hidden comment: 10uF 6.3V 0603)
C79  value 0.1uF  [C0603[1608X92]]  (hidden comment: 0.1uF 6.3V 0603)
C80  value 47uF  [C1206[3216X160]]  (hidden comment: 47uF 10V 1206)
C81  value 0.1uF  [C1206[3216X160]]  (hidden comment: 0.1uF 10V 1206)
C82  value 100pF  [C0603[1608X92]]  (hidden comment: 100pF 10V 0603)
C83  value 10nF  [C0805[2012X120]]  (hidden comment: 1uF)
C84  value 0.1uF  [C1206[3216X160]]  (hidden comment: 0.1uF 10V 1206)
C85  value 100pF  [C0603[1608X92]]  (hidden comment: 100pF 10V 0603)
C86  value 10nF  [C0805[2012X120]]  (hidden comment: 1uF)
C87  value 0.1uF  [C1206[3216X160]]  (hidden comment: 0.1uF 10V 1206)
C88  value 100pF  [C0603[1608X92]]  (hidden comment: 100pF 10V 0603)
R68  value 1M  [R0603[1608]]  (hidden comment: 1M 5% 0603)
R73  value 50R  [R0603[1608]]  (hidden comment: 50R 1% 0603)
R81  value 330R  [R0603[1608]]  (hidden comment: 330R 0.1% 0603)
R82  value 330R  [R0603[1608]]  (hidden comment: 330R 0.1% 0603)
R83  value 330R  [R0603[1608]]  (hidden comment: 330R 0.1% 0603)
R85  value 50R  [R0603[1608]]  (hidden comment: 50R 1% 0603)
R86  value 50R  [R0603[1608]]  (hidden comment: 50R 1% 0603)
R87  value 50R  [R0603[1608]]  (hidden comment: 50R 1% 0603)
R88  value 50R  [R0603[1608]]  (hidden comment: 50R 1% 0603)
R89  value 50R  [R0603[1608]]  (hidden comment: 50R 1% 0603)
R90  value 330R  [R0603[1608]]  (hidden comment: 330R 0.1% 0603)
R91  value 330R  [R0603[1608]]  (hidden comment: 330R 0.1% 0603)
R92  value 330R  [R0603[1608]]  (hidden comment: 330R 0.1% 0603)
R93  value 1K  [R0603[1608]]  (hidden comment: 1K 1% 0603)
R118  value 50R  [R0603[1608]]  (hidden comment: 50R 1% 0603)
R119  value 330R  [R0603[1608]]  (hidden comment: 330R 0.1% 0603)
R120  value 330R  [R0603[1608]]  (hidden comment: 330R 0.1% 0603)
R121  value 330R  [R0603[1608]]  (hidden comment: 330R 0.1% 0603)
R122  value 330R  [R0603[1608]]  (hidden comment: 330R 0.1% 0603)
U16  ADS1257IRGWR  [VQFN-20/RGW]
X2  7.680MHz  [OSC_HCN49]  (masked out: inside a compile mask, not in the netlist)
Y1  OSC_SiT8008BC  [OSC_4P_3R2x2R5]

### Ports
ADC (harness ADC), ADC_CLKOUT (in), OSC_PIN (in), SPI_ADC (harness SPI_ADC), STRAIN1 (out), STRAIN2 (out)

### Harnesses
SPI_ADC: MOSI, MISO, SCK, SYNC, RSTB
ADC: CSB, RDYB

### Nets
5V: C76.1 C77.1 R81.2 R90.2 U16.18(AVDD)
GND: C74#2.2 C75#2.1 C76.2 C77.2 C78.2 C79.2 C80.2 C81.2 C82.2 R68.2 R82.1 R83.1 R91.1 R92.1 R93.2 U16.9(DGND) U16.19(AGND) U16.20(REFN) U16.21(PAD) Y1.2(GND)
REF: C80.1 C81.1 C82.1 U16.1(REFP)
VCC: C74#2.1 C78.1 C79.1 U16.8(DVDD) Y1.4(VCC)
ADC_CLKOUT: R118.1 ; port ADC_CLKOUT
AINN1: R81.1 R82.2 R120.2
AINN2: R90.1 R91.2 R122.2
AINP1: R83.2 R119.2 ; port STRAIN1
AINP2: R92.2 R121.2 ; port STRAIN2
CSB: R89.2 ; port ADC.CSB
MISO: R88.2 ; port SPI_ADC.MISO
MOSI: R87.2 ; port SPI_ADC.MOSI
OSC_PIN: R93.1 Y1.1(OE/ST/NC) ; port OSC_PIN
RDYB: R85.2 ; port ADC.RDYB
RSTB: U16.7(RESET_N) ; port SPI_ADC.RSTB
SCK: R86.2 ; port SPI_ADC.SCK
SYNC: U16.6(SYNC_PDWN_N) ; port SPI_ADC.SYNC
NetC75#2_2: C75#2.2 R73.2 Y1.3(OUT)
NetC83_1: C83.1 C84.1 C85.1 R119.1 U16.2(AIN0)
NetC83_2: C83.2 C84.2 C85.2 R120.1 U16.3(AIN1)
NetC86_1: C86.1 C87.1 C88.1 R121.1 U16.4(AIN2)
NetC86_2: C86.2 C87.2 C88.2 R122.1 U16.5(AIN3)
NetR68_1: R68.1 U16.16(D0_CLKOUT) U16.17(D1)
NetR73_1: R73.1 R118.2 U16.10(CLKIN)
NetR85_1: R85.1 U16.12(DRDY_N)
NetR86_1: R86.1 U16.15(SCLK)
NetR87_1: R87.1 U16.14(DIN)
NetR88_1: R88.1 U16.13(DOUT)
NetR89_1: R89.1 U16.11(CS_N)

### Library data of the parts
C74#1 C75#1 = CAP_18pF_50V_0603_1%: 18pF 50V 1% 0603 (1608 Metric); PartNumber: 06035A180FAT2A; Manufacturer: AVX Corporation; TemperatureCoefficient: C0G; Mounting Technology: Surface Mount; PackageReference: 0603; PackageDescription: 0603 (1608 Metric); Voltage: 50V; Tolerance: 1%
C74#2 C77 = CAP_0.1uF_16V_0603_10%: 0.1uF 16V 10% 0603 (1608 Metric); PartNumber: GCM188R71C104KA37D; Manufacturer: Murata; TemperatureCoefficient: X7R; Mounting Technology: Surface Mount; PackageReference: 0603; PackageDescription: 0603 (1608 Metric); Voltage: 16V; Tolerance: 10%
C75#2 = CAP_15pF_50V_0603_1%: 15pF 50V 1% 0603 (1608 Metric); PartNumber: 06035A150FAT2A; Manufacturer: AVX Corporation; TemperatureCoefficient: C0G; Mounting Technology: Surface Mount; PackageReference: 0603; PackageDescription: 0603 (1608 Metric); Voltage: 50V; Tolerance: 1%
C76 = CAP_10uF_16V_0603_10%: 10uF 16V 10% 0603 (1608 Metric); PartNumber: GRM188R61C106KAALD; Manufacturer: Murata; TemperatureCoefficient: X5R; Mounting Technology: Surface Mount; PackageReference: 0603; PackageDescription: 0603 (1608 Metric); Voltage: 16V; Tolerance: 10%
C78 = CAP_10uF_6.3V_0603_10%: 10uF 6.3V 10% 0603 (1608 Metric); PartNumber: GRM188R60J106KE47D; Manufacturer: Murata; TemperatureCoefficient: X5R; Mounting Technology: Surface Mount; PackageReference: 0603; PackageDescription: 0603 (1608 Metric); Voltage: 6.3V; Tolerance: 10%
C79 = CAP_0.1uF_6.3V_0603_10%: as C5 on sheet LTC6803; Mounting Technology: Surface Mount; PackageReference: 0603; PackageDescription: 0603 (1608 Metric); Voltage: 6.3V; Tolerance: 10%
C80 = CAP_47uF_10V_1206_10%: 47uF 10V 10% 1206 (3216 Metric); PartNumber: GRM31CR61A476KE15L; Manufacturer: Murata; Mounting Technology: Surface Mount; PackageReference: 1206; PackageDescription: 1206 (3216 Metric); Voltage: 10V; Tolerance: 10%
C81 C84 C87 = CAP_0.1uF_10V_1206_10%: 0.1uF 10V 10% 1206 (3216 Metric); PartNumber: 885012208009; Manufacturer: Wurth; Mounting Technology: Surface Mount; PackageReference: 1206; PackageDescription: 1206 (3216 Metric); Voltage: 10V; Tolerance: 10%
C82 C85 C88 = CAP_100pF_10V_0603_10%: 100pF 10V 10% 0603 (1608 Metric); PartNumber: 885012206003; Manufacturer: Wurth; TemperatureCoefficient: X7R; Mounting Technology: Surface Mount; PackageReference: 0603; PackageDescription: 0603 (1608 Metric); Voltage: 10V; Tolerance: 10%
C83 C86 = PPS_10nF_16V_0805_2%: PPS_10nF 16V 2% 0805 (2012 metric); Manufacturer: Panasonic; PartNumber: ECH-U1C103GX5; Mounting Technology: Surface Mount; Voltage: 16V; Package Description: 0805 (2012 Metric); Package Reference: 0805; Tolerance: 2%
R68 = RES_1M_0603_5%: as R1-R3 on sheet LTC6803; Tolerance: 5%; Power: 0.25W; Mounting Technology: Surface Mount; PackageReference: 0603; PackageDescription: 0603 (1608 Metric); ComponentLink1Description: Datasheet; ComponentLink1URL: http://www.vishay.com/docs/20043/crcwhpe3.pdf
R73 R85-R89 R118 = RES_50R_0603_1%: 50R 0.25W 1% 0603 (1005 Metric); Manufacturer: Vishay / Dale; PartNumber: CRCW060349R9FKEAHP; Tolerance: 1%; Power: 0.25W; Mounting Technology: Surface Mount; PackageReference: 0603; PackageDescription: 0603 (1608 Metric); ComponentLink1Description: Datasheet; ComponentLink1URL: http://www.vishay.com/docs/20043/crcwhpe3.pdf
R81-R83 R90-R92 R119-R122 = RES_330R_0603_0.1%: 330R 0.2W 1% 0603 (1005 Metric); Manufacturer: Panasonic; PartNumber: ERJ-PB3B3300V; Tolerance: 0.1%; Power: 0.2W; Mounting Technology: Surface Mount; PackageReference: 0603; PackageDescription: 0603 (1608 Metric); ComponentLink1Description: Datasheet; ComponentLink1URL: http://www.vishay.com/docs/20043/crcwhpe3.pdf
R93 = RES_1K_0603_1%: as R8 on sheet LTC6803; Tolerance: 1%; Power: 0.25W; Mounting Technology: Surface Mount; PackageReference: 0603; PackageDescription: 0603 (1608 Metric); ComponentLink1Description: Datasheet; ComponentLink1URL: http://www.vishay.com/docs/20043/crcwhpe3.pdf
U16 = ADS1257IRGWR: 24-Bit, 30kSPS, 4-Ch Industrial ADC With Integrated PGA; Manufacturer: Texas Instruments; CompType: IC; PIN_COUNT: 21; Application_BuildNumber: *; PartNumber: ADS1257IRGWR; Alternate_PartNumber: ADS1257IRGW; PackageReference: RGW0020A; MountType: SMT; RefDes: RefDes; TYPE: TYPE; Value: Value
X2 = XTAL_HCM49_7.68MHz: Crystal Oscillator; Manufacturer: Citizen Finedevice Co Ltd; PartNumber: HCM497680000ABJT; Load Capacitance: 18pF; PackageReference: HC-49; Value: 7.680MHz
Y1 = OSC_SiT8008BC: Manufacturer: SiTIME; PartNumber: SiT8008BCT; PackageDescription: 4-SMD

## Sheet USB.SchDoc
size A4
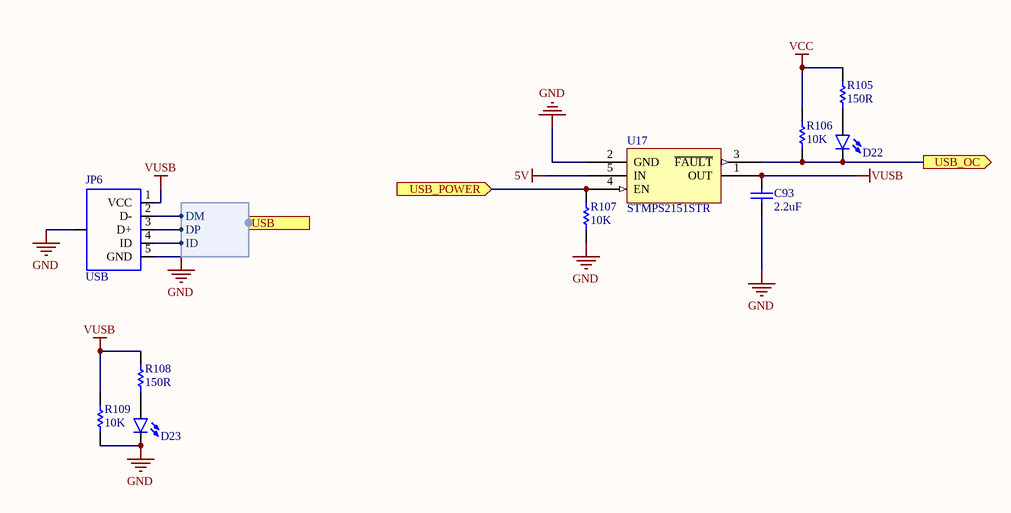
[diagram p15: USB.SchDoc]

### Parts
C93  value 2.2uF  [C1206[3216X160]]  (hidden comment: 2.2uF 16V 1206)
D22  USB_OC  [LED0603]  (value not drawn)
D23  USB_PW  [LED0603]  (value not drawn)
JP6  USB  [USB_MICROB_VERT]
R105  value 150R  [R0603[1608]]  (hidden comment: 150R 1% 0603)
R106  value 10K  [R0603[1608]]  (hidden comment: 10K 1% 0603)
R107  value 10K  [R0603[1608]]  (hidden comment: 10K 1% 0603)
R108  value 150R  [R0603[1608]]  (hidden comment: 150R 1% 0603)
R109  value 10K  [R0603[1608]]  (hidden comment: 10K 1% 0603)
U17  STMPS2151STR  [SOT-23-5L]

### Ports
USB (harness USB), USB_OC (out), USB_POWER (in)

### Harnesses
USB: DM, DP, ID

### Nets
5V: U17.5(IN)
GND: C93.2 D23.C JP6.5(GND) JP6.6(SHIELD) R107.1 R109.1 U17.2(GND)
VCC: R105.2 R106.2
VUSB: C93.1 JP6.1(VCC) R108.2 R109.2 U17.1(OUT)
USB_OC: D22.C R106.1 U17.3(~{FAULT}) ; port USB_OC
USB_POWER: R107.2 U17.4(EN) ; port USB_POWER
NetD22_A: D22.A R105.1
NetD23_A: D23.A R108.1
NetJP6_2: JP6.2(D-) ; port USB.DM
NetJP6_3: JP6.3(D+) ; port USB.DP
NetJP6_4: JP6.4(ID) ; port USB.ID

### Library data of the parts
C93 = CAP_2.2uF_16V_1206_10%: 2.2uF 16V 10% X7R 1206 (3216 Metric); PartNumber: C1206C225K4RACAUTO; Manufacturer: KEMET; Mounting Technology: Surface Mount; PackageReference: 1206; PackageDescription: 1206 (3216 Metric); Voltage: 16V; Tolerance: 10%
D22 D23 = LED_0603_GREEN_5mA: PartNumber: LTST-C193TGKT-5A; Manufacturer: Lite-On Inc.; PackageReference: 0603; PackageDescription: 0603 (1608 Metric); Mounting Technology: Surface Mount
JP6 = USB_MICROB_VERT: PartNumber: 614105150721; Manufacturer: Wurth Electronics; Mounting Technology: Through Hole; PackageReference: USB - Micro B
R105 R108 = RES_150R_0603_1%: 150R 0.25W 1% 0603 (1005 Metric); Manufacturer: Vishay / Dale; PartNumber: CRCW0603150RFKEAHP; Tolerance: 1%; Power: 0.25W; Mounting Technology: Surface Mount; PackageReference: 0603; PackageDescription: 0603 (1608 Metric); ComponentLink1Description: Datasheet; ComponentLink1URL: http://www.vishay.com/docs/20043/crcwhpe3.pdf
R106 R107 R109 = RES_10K_0603_1%: as R61 on sheet Flash; Tolerance: 1%; Power: 0.25W; Mounting Technology: Surface Mount; PackageReference: 0603; PackageDescription: 0603 (1608 Metric); ComponentLink1Description: Datasheet; ComponentLink1URL: http://www.vishay.com/docs/20065/rcse3.pdf
U17 = STMPS2141STR

## Nets that join several sheets
5V: 3V3 (5 pins), Connectors (JPB.1 JPB.3), ADS1257 (5 pins), USB (U17.5)
B+: Switches (D16.1), CurrentSense (R53.2)
C1: Switches (D18.1 Q9.2 R41.1), Connectors (*1.2), RTCC (C34.2 U10.3)
C+: Charging (C20#1.2 C21#1.2 L2.1 R29.2), Switches (R27.2 R38.2), Connectors (JP10.7)
CHG+: Charging (C22.1 D5.1 D6.1 R32.2), Switches (5 pins)
GND: Charging (15 pins), Bluetooth (R84.2 U13.1), 3V3 (18 pins), MCU (25 pins), Switches (19 pins), Connectors (19 pins), CAN (C32.2 U8.2), RTCC (C34.1 C35.2 U10.4), Buzzer (Q13.2 R59.1), CurrentSense (C33.1 U9.1 U9.2 U9.7), LTC6803 (6 pins), Flash (C40.2 U11.4), ADS1257 (20 pins), USB (7 pins)
SWT: Switches (5 pins), Connectors (JP4.1 JP21.1)
V-: LTC6803 (5 pins), U_LTC6803/12 (C23_12.1), U_LTC6803/11 (C23_11.1), U_LTC6803/10 (C23_10.1), U_LTC6803/9 (C23_9.1), U_LTC6803/8 (C23_8.1), U_LTC6803/7 (C23_7.1), U_LTC6803/6 (C23_6.1), U_LTC6803/5 (C23_5.1), U_LTC6803/4 (C23_4.1), U_LTC6803/3 (C23_3.1), U_LTC6803/2 (C23_2.1), U_LTC6803/1 (C23_1.1)
VBB: Switches (8 pins), CurrentSense (R53.1)
VCC: Charging (6 pins), Bluetooth (U13.15 U13.24), 3V3 (5 pins), MCU (30 pins), Switches (Q15.2 U7.5 U7.7), Connectors (11 pins), CAN (C32.1 U8.3), RTCC (C35.1 U10.8), Buzzer (LS1.1), CurrentSense (C33.2 R52.2 U9.6), LTC6803 (R1.1 R2.1 R3.1 R8.1), Flash (C40.1 R61.2 U11.8), ADS1257 (5 pins), USB (R105.2 R106.2)
VDD: 3V3 (5 pins), Switches (Q7.3 R50.1), LTC6803 (L1.1)
VUSB: 3V3 (D11.2 D15.1), MCU (U2.68), Connectors (JP16.VBUS), USB (5 pins)
ADC_CLKOUT: MCU (U2.90), ADS1257 (R118.1)
ALERT: MCU (U2.36), CurrentSense (R52.1 U9.3)
BAT_DIO: MCU (U2.38), Connectors (JP2.2)
BAT_IND: MCU (U2.24), Connectors (JP13.2)
BOOST: MCU (U2.37), Connectors (JP10.4)
BUZZER: MCU (U2.64), Buzzer (Q13.1 R59.2)
CELL0: Connectors (JP1.1), LTC6803 (R10.1), U_LTC6803/1 (D9_1.C R35_1.1)
CELL1: Connectors (*1.1 JP1.2), U_LTC6803/2 (D9_2.C R35_2.1), U_LTC6803/1 (Q3_1.2 R34_1.1)
CELL2: Connectors (JP1.3), U_LTC6803/3 (D9_3.C R35_3.1), U_LTC6803/2 (Q3_2.2 R34_2.1)
CELL3: Connectors (JP1.4), U_LTC6803/4 (D9_4.C R35_4.1), U_LTC6803/3 (Q3_3.2 R34_3.1)
CELL4: Connectors (JP1.5), U_LTC6803/5 (D9_5.C R35_5.1), U_LTC6803/4 (Q3_4.2 R34_4.1)
CELL5: Connectors (JP1.6), U_LTC6803/6 (D9_6.C R35_6.1), U_LTC6803/5 (Q3_5.2 R34_5.1)
CELL6: Connectors (JP1.7), U_LTC6803/7 (D9_7.C R35_7.1), U_LTC6803/6 (Q3_6.2 R34_6.1)
CELL7: Connectors (JP1.8), U_LTC6803/8 (D9_8.C R35_8.1), U_LTC6803/7 (Q3_7.2 R34_7.1)
CELL8: Connectors (JP1.9), U_LTC6803/9 (D9_9.C R35_9.1), U_LTC6803/8 (Q3_8.2 R34_8.1)
CELL9: Connectors (JP1.10), U_LTC6803/10 (D9_10.C R35_10.1), U_LTC6803/9 (Q3_9.2 R34_9.1)
CELL10: Connectors (JP1.11), U_LTC6803/11 (D9_11.C R35_11.1), U_LTC6803/10 (Q3_10.2 R34_10.1)
CELL11: Connectors (JP1.12), U_LTC6803/12 (D9_12.C R35_12.1), U_LTC6803/11 (Q3_11.2 R34_11.1)
CELL12: Connectors (JP1.13), U_LTC6803/12 (Q3_12.2 R34_12.1)
CHG_DETECT: MCU (U2.35), Switches (R39.1 R40.2)
DSG_DETECT: MCU (U2.34), Switches (Q18.1 R80.1 R103.2)
I2C_SYS.SCL: Connectors (JP10.3), RTCC (U10.6), CurrentSense (U9.5)
I2C_SYS.SDA: Connectors (JP10.2), RTCC (U10.5), CurrentSense (U9.4)
IO_IRQ: MCU (U2.9), Connectors (JP13.6)
IO_RST: MCU (U2.8), Connectors (JP13.7)
LED_STRIP_L: MCU (U2.23), Connectors (JP13.3)
LED_STRIP_R: MCU (U2.22), Connectors (JP13.4)
MPU_INT1: MCU (U2.96), Connectors (JP13.11)
MPU_INT2: MCU (U2.95), Connectors (JP13.12)
NetC1_2: Connectors (JP2.4), LTC6803 (C1.2 R4.1 U1.32)
NetC5_2: LTC6803 (C5.2 R10.2 U1.29), U_LTC6803/1 (D8_1.2)
NetC23_1_2: LTC6803 (U1.27), U_LTC6803/2 (D8_2.2), U_LTC6803/1 (C23_1.2 D8_1.1 R34_1.2)
NetC23_2_2: LTC6803 (U1.25), U_LTC6803/3 (D8_3.2), U_LTC6803/2 (C23_2.2 D8_2.1 R34_2.2)
NetC23_3_2: LTC6803 (U1.23), U_LTC6803/4 (D8_4.2), U_LTC6803/3 (C23_3.2 D8_3.1 R34_3.2)
NetC23_4_2: LTC6803 (U1.21), U_LTC6803/5 (D8_5.2), U_LTC6803/4 (C23_4.2 D8_4.1 R34_4.2)
NetC23_5_2: LTC6803 (U1.19), U_LTC6803/6 (D8_6.2), U_LTC6803/5 (C23_5.2 D8_5.1 R34_5.2)
NetC23_6_2: LTC6803 (U1.17), U_LTC6803/7 (D8_7.2), U_LTC6803/6 (C23_6.2 D8_6.1 R34_6.2)
NetC23_7_2: LTC6803 (U1.15), U_LTC6803/8 (D8_8.2), U_LTC6803/7 (C23_7.2 D8_7.1 R34_7.2)
NetC23_8_2: LTC6803 (U1.13), U_LTC6803/9 (D8_9.2), U_LTC6803/8 (C23_8.2 D8_8.1 R34_8.2)
NetC23_9_2: LTC6803 (U1.11), U_LTC6803/10 (D8_10.2), U_LTC6803/9 (C23_9.2 D8_9.1 R34_9.2)
NetC23_10_2: LTC6803 (U1.9), U_LTC6803/11 (D8_11.2), U_LTC6803/10 (C23_10.2 D8_10.1 R34_10.2)
NetC23_11_2: LTC6803 (U1.7), U_LTC6803/12 (D8_12.2), U_LTC6803/11 (C23_11.2 D8_11.1 R34_11.2)
NetC23_12_2: LTC6803 (U1.5), U_LTC6803/12 (C23_12.2 D8_12.1 R34_12.2)
NetC90_2: Connectors (JP2.3), LTC6803 (C90.2 R66.1 U1.33)
NetJP3_1: Connectors (JP3.1), CAN (R58.2 U8.7)
NetJP3_2: Connectors (JP3.2), CAN (R58.1 U8.6)
NetJP4_2: Switches (R46.2), Connectors (JP4.2)
NetJP21_2: Switches (R80.2), Connectors (JP21.2)
NetQ1_1: MCU (Q1.1), Switches (Q12.1 R46.1 R47.2)
NetQ3_1_1: LTC6803 (U1.28), U_LTC6803/1 (Q3_1.1)
NetQ3_2_1: LTC6803 (U1.26), U_LTC6803/2 (Q3_2.1)
NetQ3_3_1: LTC6803 (U1.24), U_LTC6803/3 (Q3_3.1)
NetQ3_4_1: LTC6803 (U1.22), U_LTC6803/4 (Q3_4.1)
NetQ3_5_1: LTC6803 (U1.20), U_LTC6803/5 (Q3_5.1)
NetQ3_6_1: LTC6803 (U1.18), U_LTC6803/6 (Q3_6.1)
NetQ3_7_1: LTC6803 (U1.16), U_LTC6803/7 (Q3_7.1)
NetQ3_8_1: LTC6803 (U1.14), U_LTC6803/8 (Q3_8.1)
NetQ3_9_1: LTC6803 (U1.12), U_LTC6803/9 (Q3_9.1)
NetQ3_10_1: LTC6803 (U1.10), U_LTC6803/10 (Q3_10.1)
NetQ3_11_1: LTC6803 (U1.8), U_LTC6803/11 (Q3_11.1)
NetQ3_12_1: LTC6803 (U1.6), U_LTC6803/12 (Q3_12.1)
NetR22_2: MCU (R22.2), Switches (U7.10)
NRF_CE: MCU (U2.57), Connectors (JP18.3)
NRF_IRQ: MCU (U2.58), Connectors (JP18.8)
POWER_GATE: MCU (U2.40), Switches (Q11.1 R45.2)
RTCC_INT: MCU (U2.39), Switches (Q9.1 R41.2), RTCC (U10.7)
SD_DETECT: MCU (U2.77), Connectors (JP19.9 R98.2)
SPI_SYS.MISO: LTC6803 (R8.2 U1.43), Flash (U11.2)
SPI_SYS.MOSI: LTC6803 (R2.2 U1.42), Flash (U11.5)
SPI_SYS.SCK: LTC6803 (R1.2 U1.41), Flash (U11.6)
USB_ID: MCU (U2.69), Connectors (JP16.ID)
USB_N: MCU (R11.1), Connectors (JP16.D-)
USB_OC: MCU (U2.84), USB (D22.C R106.1 U17.3)
USB_P: MCU (R12.1), Connectors (JP16.D+)
USB_POWER: MCU (U2.85), USB (R107.2 U17.4)
WDTB: Switches (Q15.1), LTC6803 (R7.1 U1.37)